# EAGLE design transistor (EAGLE 6.6.0)
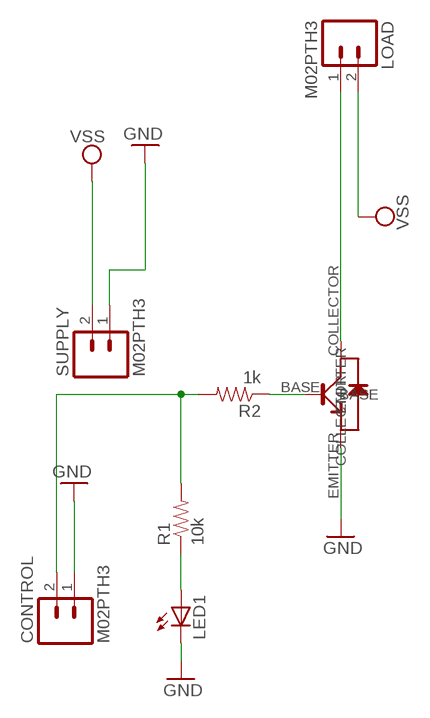
[diagram p0: schematic, sheet 1]

## Parts
CONTROL  M02PTH3  [1X02_LONGPADS]
LED1  LEDCHIPLED_0603  [CHIPLED_0603]
LOAD  M02PTH3  [1X02_LONGPADS]
R1  10k  RESISTOR0603-RES  [0603-RES]
R2  1k  RESISTOR0603-RES  [0603-RES]
SUPPLY  M02PTH3  [1X02_LONGPADS]
U$1  STB13007DT4  [D2PAK-TO263]

## Nets
COLLECTOR: LOAD.1 U$1.COLLECTOR
GND: CONTROL.1 LED1.C SUPPLY.1 U$1.EMITTER
N$1: LED1.A R1.1
N$2: R2.1 U$1.BASE
N$4: CONTROL.2 R1.2 R2.2
VSS: LOAD.2 SUPPLY.2

## Library data of the parts
CONTROL LOAD SUPPLY = SparkFun-Connectors:M02: Standard 2-pin 0.1" header. Use with - straight break away headers ( PRT-00116) - right angle break away headers (PRT-00553) - swiss pins (PRT-00743) - machine pins (PRT-00117) - female headers (PRT-00115) Molex polarized connector foot print use with: PRT-08233 with associated crimp pins and housings. 2.54_SCREWTERM for use with PRT-10571. 3.5mm Screw Terminal footprints for PRT-08084 5mm Screw Terminal footprints for use with PRT-08433
LED1 = adafruit:LED: LED OSRAM: - CHIPLED LG R971, LG N971, LY N971, LG Q971, LY Q971, LO R971, LY R971 LH N974, LH R974 LS Q976, LO Q976, LY Q976 LO Q996 - Hyper CHIPLED LW Q18S LB Q993, LB Q99A, LB R99A - SideLED LS A670, LO A670, LY A670, LG A670, LP A670 LB A673, LV A673, LT A673, LW A673 LH A674 LY A675 LS A676, LA A676, LO A676, LY A676, LW A676 LS A679, LY A679, LG A679 - Hyper Micro SIDELED® LS Y876, LA Y876, LO Y876, LY Y876 LT Y87S - SmartLED LW L88C, LW L88S LB L89C, LB L89S, LG L890 LS L89K, LO L89K, LY L89K LS L896, LA L896, LO L896, LY L896 - TOPLED LS T670, LO T670, LY T670, LG T670, LP T670 LSG T670, LSP T670, LSY T670, LOP T670, LYG T670 LG T671, LOG T671, LSG T671 LB T673, LV T673, LT T673, LW T673 LH T674 LS T676, LA T676, LO T676, LY T676, LB T676, LH T676, LSB T676, LW T676 LB T67C, LV T67C, LT T67C, LS T67K, LO T67K, LY T67K, LW E67C LS E67B, LA E67B, LO E67B, LY E67B, LB E67C, LV E67C, LT E67C LW T67C LS T679, LY T679, LG T679 LS T770, LO T770, LY T770, LG T770, LP T770 LB T773, LV T773, LT T773, LW T773 LH T774 LS E675, LA E675, LY E675, LS T675 LS T776, LA T776, LO T776, LY T776, LB T776 LHGB T686 LT T68C, LB T68C - Hyper Mini TOPLED® LB M676 - Mini TOPLED Santana® LG M470 LS M47K, LO M47K, LY M47K Source: http://www.osram.convergy.de/
R1 R2 = SparkFun-Resistors:RESISTOR: Resistor Basic schematic elements and footprints for 0603, 1206, and PTH resistors.
U$1 = ITP_Lab:STB13007DT4

## Board
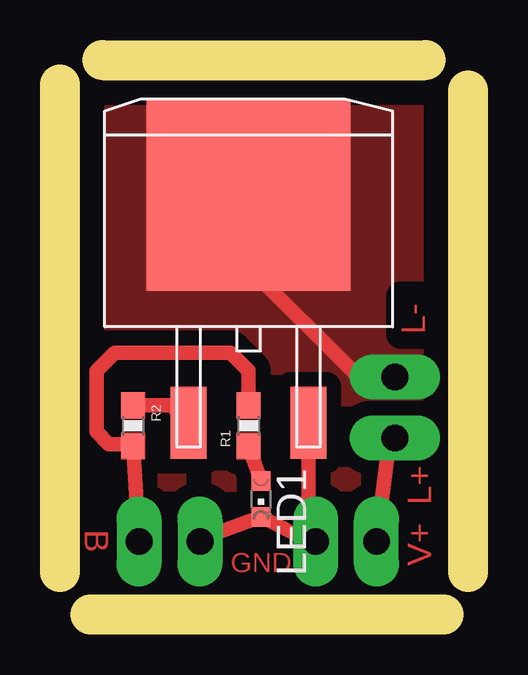
[diagram p1: board, top side]

Size 17.02 x 23.11 mm. Coordinates in mm from the lower left corner, seen from the top.
Outline: 0,1.78 0,22.1
Outline: 1.78,23.11 15.24,23.11
Outline: 17.02,21.84 17.02,1.78
Outline: 16,0 1.27,0
Copper layers (1*16): Top 0.035mm / dielectric 1.5mm / Bottom 0.035mm
Design rules "default": minimum track width 10mil, minimum drill 24mil, track to track 8mil, track to pad 8mil, pad to pad 8mil, via to via 8mil, smd to smd 8mil, copper to edge 40mil, drill to drill 8mil, minimum pad ring 10mil, minimum via ring 8mil, stop-mask expansion 4mil, vias tented up to drill 0mil, thermal gap 10mil

### Footprints (pad centres in the part's own frame; a part is rotated, then mirrored left to right if it is on the bottom)
1X02_LONGPADS = drill 1.118 pad 1.88 long: 1 0,0; 2 2.54,0
CHIPLED_0603 = smd 0.8 x 0.8: A 0,-0.75; C 0,0.75
0603-RES = smd 1.1 x 1: 1 -0.85,0; 2 0.85,0
D2PAK-TO263 = smd 1.5 x 3: BASE -2.5,-7.5; EMITTER 2.5,-7.5 | smd 8.5 x 8: COLLECTOR 0,2

### Placement (x,y rotation side)
CONTROL  5.84,3.05 180 top
LED1  8.38,4.83 180 top
LOAD  13.97,9.91 270 top
R1  7.87,7.87 90 top
R2  3.05,7.87 270 top
SUPPLY  10.67,3.05 0 top
U$1  7.87,15.49 0 top

### Tracks (layer width: path | path; a pad name or v marks a point on that pad's centre or on a via)
COLLECTOR
  Top 0.61: LOAD.1 12.45,9.91 7.87,14.48 U$1.COLLECTOR
  pour Top (isolate 0.61, no thermals): 0.25,0 0.25,22.86 16.76,22.86 16.76,0
GND
  Top 0.61: CONTROL.1 5.6,3.06 LED1.C 10.41,3.06 | 10.41,3.06 11.16,3.06 SUPPLY.1 | U$1.EMITTER 10.37,3.1 10.41,3.06
N$1
  Top 0.61: LED1.A R1.1
N$2
  Top 0.61: R2.1 4.64,8.72 U$1.BASE
N$4
  Top 0.61: R1.2 7.87,10.16 7.11,10.92 2.29,10.92 1.52,10.16 1.52,7.62 2.03,7.11 2.96,7.11 R2.2 CONTROL.2
VSS
  Top 0.61: SUPPLY.2 13.72,7.11 LOAD.2

### Text on the board
Top: L- | L+ | B | V+ | GND